# EAGLE design SerLCD_16x2_pb (EAGLE 9.5.2)
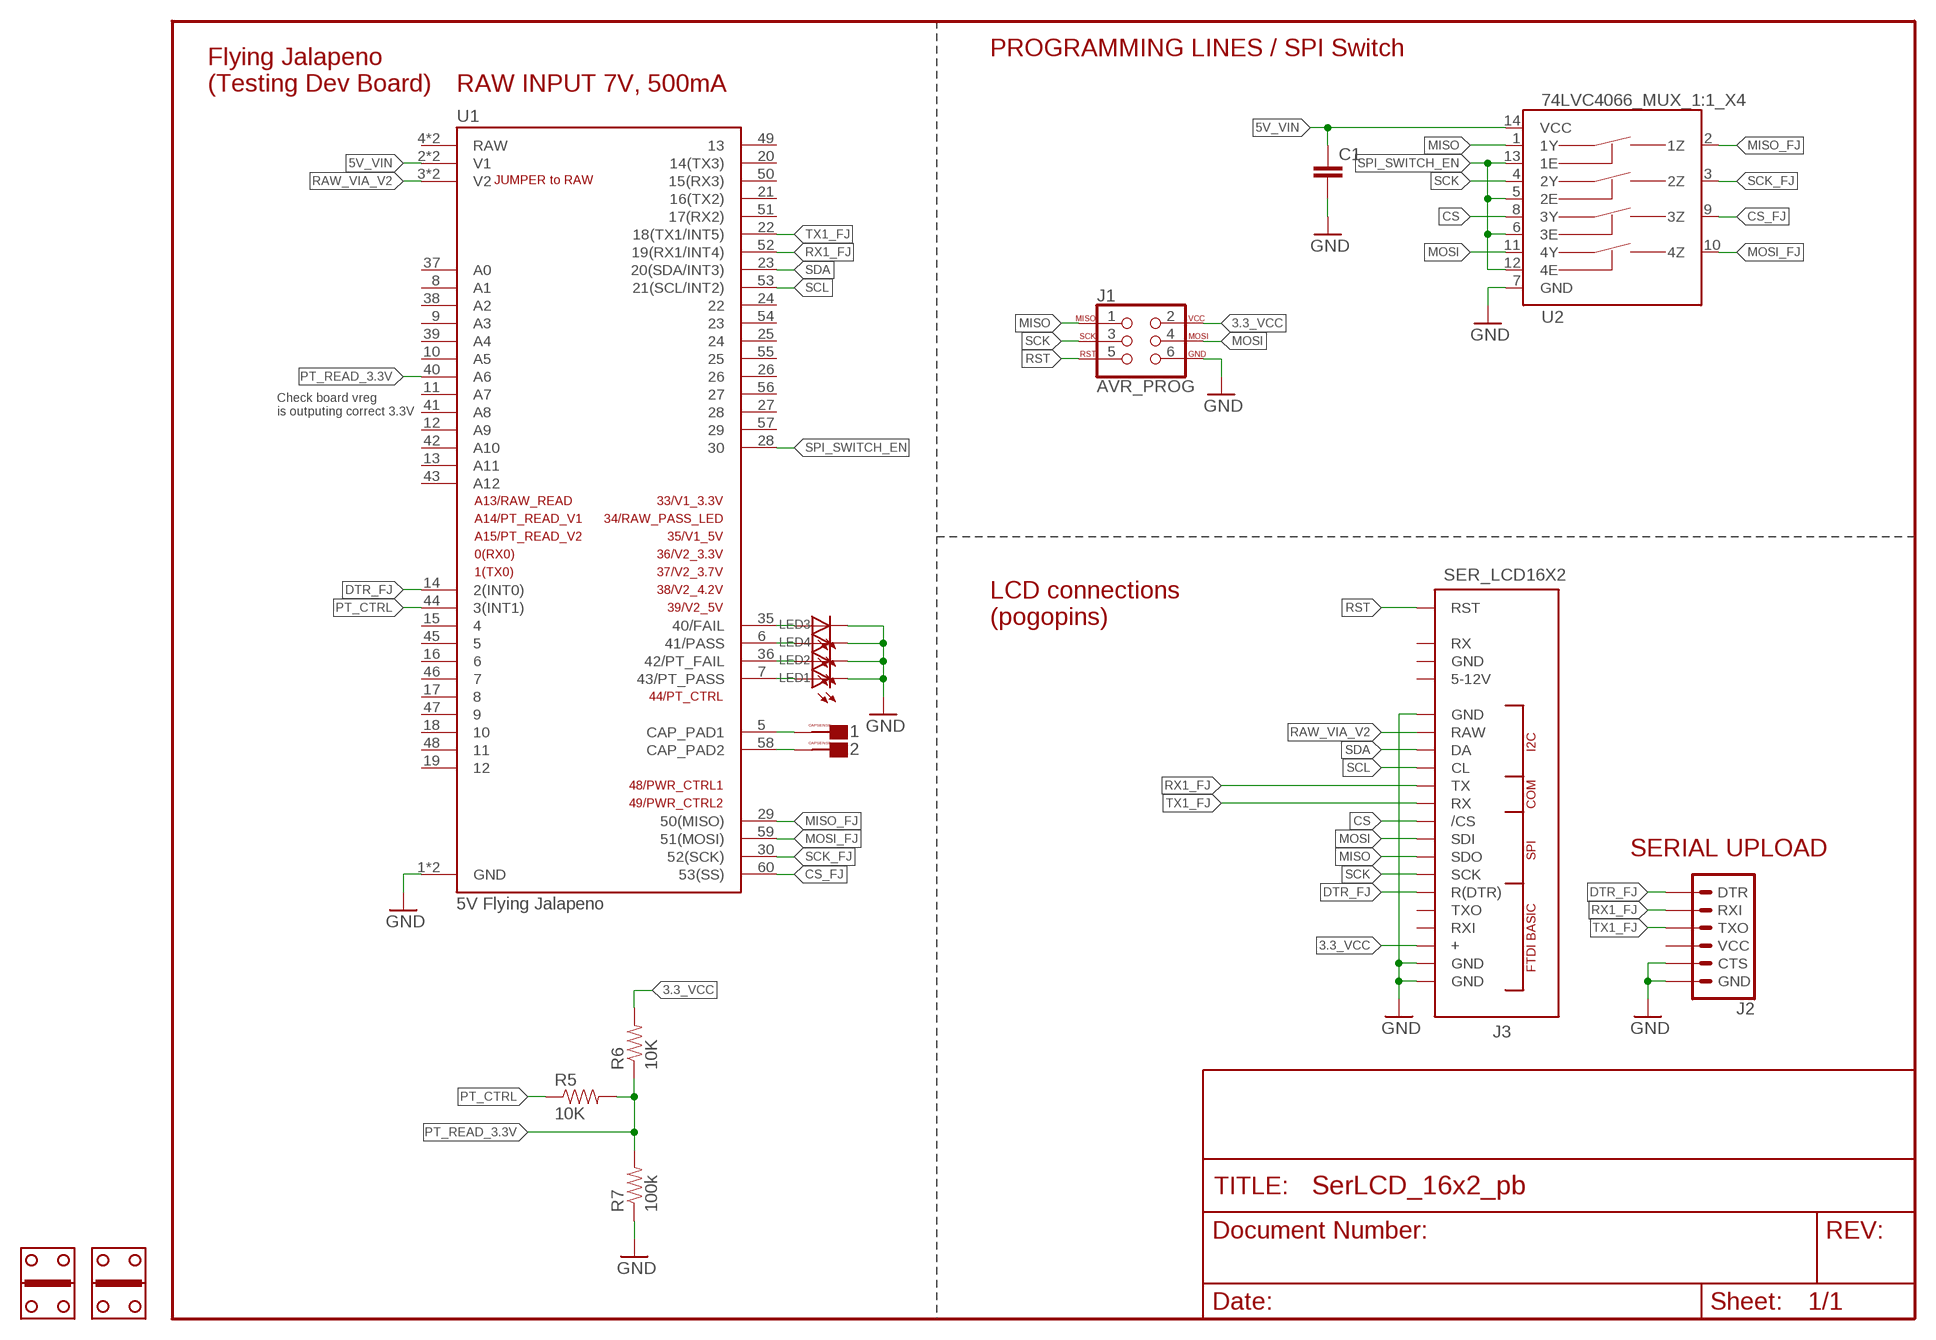
[diagram p0: schematic, sheet 1]

## Parts
1  CAPSENSE_BUTTON_PAD_ONLY  [CAPSENSE_BUTTON_PADS_ONLY]
2  CAPSENSE_BUTTON_PAD_ONLY  [CAPSENSE_BUTTON_PADS_ONLY]
C1  CAP0603-CAP  [0603-CAP]
J1  AVR_PROG  AVR_SPI_PROG_3X22X3_LOCK  [2X3_LOCK]
J2  6_PIN_SERIAL_TARGETLOCK  [1X06_LOCK]
J3  SER_LCD16X2  [SER_LCD_16X2]
LED1  LED1206  [LED-1206]
LED2  LED1206  [LED-1206]
LED3  LED1206  [LED-1206]
LED4  LED1206  [LED-1206]
R5  10K  10KOHM1/10W1%(0603)0603  [0603-RES]
R6  10K  10KOHM1/10W1%(0603)0603  [0603-RES]
R7  100k  100KOHM1/10W1%(0603)  [0603-RES]
U1  5V Flying Jalapeno  FLYING_JALAPENO_V3MALE  [FLYING_JALAPENO_V3_1_M]
U2  74LVC4066_MUX_1:1_X4  [SO14]
U$6  GOLD_HINDGEPB  [GOLD_HINDGE]
U$7  GOLD_HINDGEPB  [GOLD_HINDGE]

## Nets
3.3_VCC: J1.2 J3.P$3(+) R6.2
5V_VIN [twenty_mil]: C1.1 U1.2(V1) U1.32(V1) U2.14(VCC)
CS: J3.P$10(/CS) U2.8(3Y)
CS_FJ: U1.60(53(SS)) U2.9(3Z)
DTR_FJ: J2.1(DTR) J3.P$6(R(DTR)) U1.14(2(INT0))
GND [twelve_mil]: C1.2 J1.6 J2.5(CTS) J2.6(GND) J3.P$1(GND) J3.P$2(GND) J3.P$16(GND) LED1.C LED2.C LED3.C LED4.C R7.1 U1.1(GND) U1.31(GND) U2.7(GND)
MISO: J1.1 J3.P$8(SDO) U2.1(1Y)
MISO_FJ: U1.29(50(MISO)) U2.2(1Z)
MOSI: J1.4 J3.P$9(SDI) U2.11(4Y)
MOSI_FJ: U1.59(51(MOSI)) U2.10(4Z)
N$1 [eight_mil]: 1.CAPSENSE_PAD(CAPSENSE) U1.5(CAP_PAD1)
N$2: 2.CAPSENSE_PAD(CAPSENSE) U1.58(CAP_PAD2)
N$3 [eight_mil]: LED1.A U1.7(43/PT_PASS)
N$4 [eight_mil]: LED2.A U1.36(42/PT_FAIL)
N$5: LED3.A U1.35(40/FAIL)
N$6: LED4.A U1.6(41/PASS)
PT_CTRL: R5.1 U1.44(3(INT1))
PT_READ_3.3V: R5.2 R6.1 R7.2 U1.40(A6)
RAW_VIA_V2: J3.P$15(RAW) U1.3(V2) U1.33(V2)
RST: J1.5 J3.P$20(RST)
RX1_FJ: J2.2(RXI) J3.P$12(TX) U1.52(19(RX1/INT4))
SCK: J1.3 J3.P$7(SCK) U2.4(2Y)
SCK_FJ: U1.30(52(SCK)) U2.3(2Z)
SCL: J3.P$13(CL) U1.53(21(SCL/INT2))
SDA: J3.P$14(DA) U1.23(20(SDA/INT3))
SPI_SWITCH_EN: U1.28 U2.5(2E) U2.6(3E) U2.12(4E) U2.13(1E)
TX1_FJ: J2.3(TXO) J3.P$11(RX) U1.22(18(TX1/INT5))
Unconnected: J2.4(VCC) J3.P$4(RXI) J3.P$5(TXO) J3.P$17(5-12V) J3.P$18(GND) J3.P$19(RX) U1.4(RAW) U1.8(A1) U1.9(A3) U1.10(A5) U1.11(A7) U1.12(A9) U1.13(A11) U1.15 U1.16 U1.17 U1.18 U1.19 U1.20(14(TX3)) U1.21(16(TX2)) U1.24 U1.25 U1.26 U1.27 U1.34(RAW) U1.37(A0) U1.38(A2) U1.39(A4) U1.41(A8) U1.42(A10) U1.43(A12) U1.45 U1.46 U1.47 U1.48 U1.49 U1.50(15(RX3)) U1.51(17(RX2)) U1.54 U1.55 U1.56 U1.57

## Notes on the sheet
- PROGRAMMING LINES / SPI Switch
- Flying Jalapeno
  (Testing Dev Board)
- RAW INPUT 7V, 500mA
- JUMPER to RAW
- Check board vreg 
  is outputing correct 3.3V
- LCD connections
  (pogopins)
- SERIAL UPLOAD

## Library data of the parts
1 2 = Testing:CAPSENSE_BUTTON_PAD_ONLY
C1 = Testing:CAP: Capacitor Standard 0603 ceramic capacitor, and 0.1" leaded capacitor.
J1 = SparkFun-Connectors:AVR_SPI_PROG_3X2: AVR ISP 6 Pin This is the reduced ISP connector for AVR programming. Common on Arduino. This footprint will take up less PCB space and can be used with a 10-pin to 6-pin adapter such as SKU: BOB-08508 **Special note about "TEST_POINT" package. The stop mask is on the top side, so if you want your programming test points to be on the bottom of your board, make sure to place this package on the bottom side of the board. This also ensure that the orientation to program from the bottom side will be correct.
J2 = SparkFun-Connectors:6_PIN_SERIAL_TARGET: 6-pin header connection for use with the "FTDI BASIC" pinout - TARGET SIDE. Also known as "Arduino Serial Program Header". It is used to mate with our FTDI Basic serial programmers using the Arduino IDE. Note, this device has "TARGET" in the name. It is intended to be used on a design that contains a target micro-controller that you wish to program. The "sister" device, named "CABLE" is inteneded to be used on a design that usually lives on the end of your USB cable and prvides the converter chip (FTDI232 or FTDI231x) to commnicate serial RX/TX. You can populate with some of these: Break Away Headers - Straight <https://www.sparkfun.com/products/116> (PRT-00116) For reference (or to suit your programming needs) check out these designs: SparkFun FTDI Basic Breakout - 5V <https://www.sparkfun.com/products/9716> (DEV-09716) SparkFun FTDI Basic Breakout - 3.3V <https://www.sparkfun.com/products/9873> (DEV-09873) SparkFun FTDI SmartBasic <https://www.sparkfun.com/products/12935> (DEV-12935) SparkFun Beefy 3 - FTDI Basic Breakout <https://www.sparkfun.com/products/13746> (DEV-13746)
J3 = SerLCD_dimensions:SER_LCD
LED1-LED4 = Testing:LED: LEDs Standard schematic elements and footprints for 5mm, 3mm, 1206, and 0603 sized LEDs. 5mm - Spark Fun Electronics SKU : COM-00529 (and others)
R5 R6 = SparkFun-Resistors:10KOHM1/10W1%(0603): RES-00824; PROD_ID: RES-00824
R7 = SparkFun-Resistors:100KOHM1/10W1%(0603): RES-07828; PROD_ID: RES-07828
U1 = Testing:FLYING_JALAPENO_V3
U2 = Testing:74LVC4066_MUX_1:1_X4
U$6 U$7 = Testing:GOLD_HINDGE

## Net classes
1 vcc1: width 0.203 mm
3 VCC2: width 0.381 mm, drill 0.508 mm, clearance 0.254 mm to class 0
8 eight_mil: width 0.203 mm, clearance 0.127 mm
9 twelve_mil: width 0.305 mm, clearance 0.127 mm
10 twenty_mil: width 0.508 mm, clearance 0.127 mm
11 thirty_mil: width 0.762 mm, clearance 0.127 mm
13 20_mil: width 0.508 mm, drill 0.508 mm

## Board
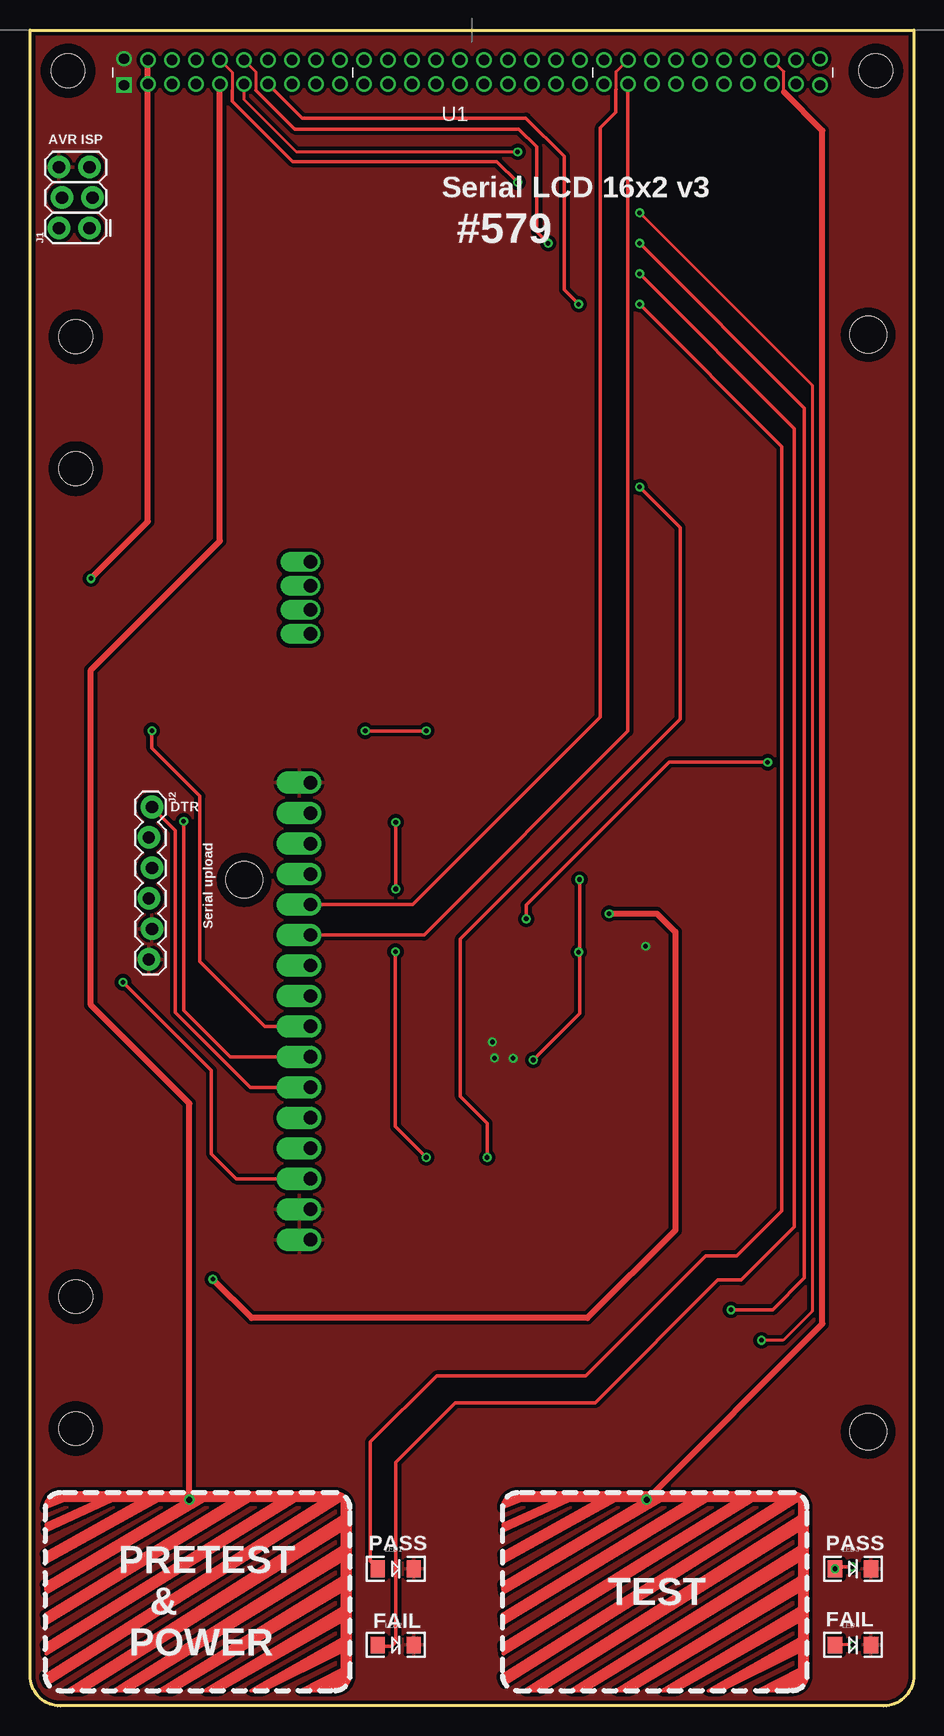
[diagram p1: board, top side]
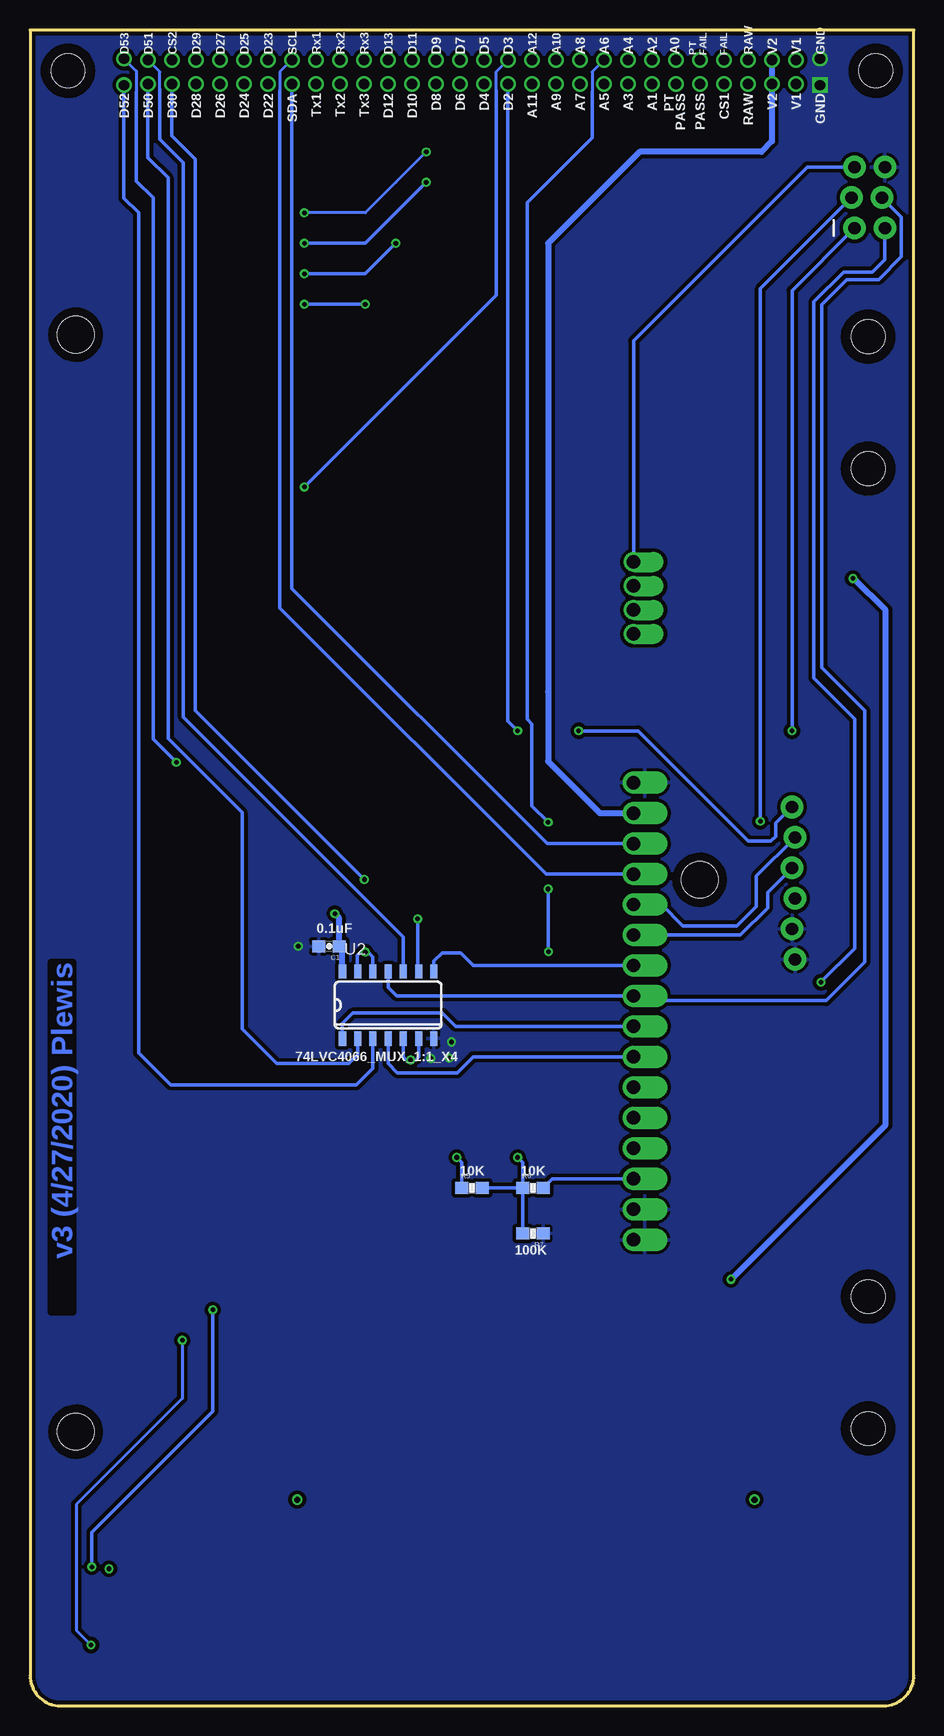
[diagram p2: board, bottom side, seen from below]

Size 73.66 x 139.7 mm. Coordinates in mm from the lower left corner, seen from the top.
Outline: 2.54,0 arc-90 0,2.54 0,139.7 73.66,139.7 73.66,2.54 arc-90 71.12,0 2.54,0
Copper layers (1*16): Top 0.035mm / dielectric 1.5mm / Bottom 0.035mm
Design rules "SparkFun-2-layer-TIGHT *": minimum track width 10mil, minimum drill 15mil, track to track 7mil, track to pad 7mil, pad to pad 7mil, via to via 7mil, smd to smd 7mil, copper to edge 7mil, drill to drill 7mil, minimum pad ring 7mil, minimum via ring 7mil, stop-mask expansion 4mil, vias tented up to drill 25mil, thermal gap 10mil

### Footprints (pad centres in the part's own frame; a part is rotated, then mirrored left to right if it is on the bottom)
CAPSENSE_BUTTON_PADS_ONLY = drill 0.508: CAPSENSE_PAD -0.686,7.036
0603-CAP = smd 1.1 x 1: 1 -0.85,0; 2 0.85,0
2X3_LOCK = drill 1.016 pad 1.88: 1 0,0.127; 2 0,2.667; 3 2.54,-0.127; 4 2.54,2.413; 5 5.08,0.127; 6 5.08,2.667
1X06_LOCK = drill 1.016 pad 1.88: 1 0,0; 2 2.54,-0.254; 3 5.08,0; 4 7.62,-0.254; 5 10.16,0; 6 12.7,-0.254
SER_LCD_16X2 = drill 1.118 pad 1.88 offset: P$1 9.652,33.782; P$2 12.192,33.782; P$3 14.732,33.782; P$4 17.272,33.782; P$5 19.812,33.782; P$6 22.352,33.782; P$7 24.892,33.782; P$8 27.432,33.782; P$9 29.972,33.782; P$10 32.512,33.782; P$11 35.052,33.782; P$12 37.592,33.782; P$13 40.132,33.782; P$14 42.672,33.782; P$15 45.212,33.782; P$16 47.752,33.782 | drill 1.118 pad 1.524 offset: P$17 60.142,33.782; P$18 62.142,33.782; P$19 64.142,33.782; P$20 66.142,33.782
LED-1206 = smd 1.2 x 1.4: A -1.5,0; C 1.5,0
0603-RES = smd 1.1 x 1: 1 -0.85,0; 2 0.85,0
FLYING_JALAPENO_V3_1_M = drill 0.85 square: 1 -29,-4.592 | drill 0.85: 2 -27,-4.492; 3 -25,-4.492; 4 -23,-4.492; 5 -21,-4.492; 6 -19,-4.492; 7 -17,-4.492; 8 -15,-4.492; 9 -13,-4.492; 10 -11,-4.492; 11 -9,-4.492; 12 -7,-4.492; 13 -5,-4.492; 14 -3,-4.492; 15 -1,-4.492; 16 1,-4.492; 17 3,-4.492; 18 5,-4.492; 19 7,-4.492; 20 9,-4.492; 21 11,-4.492; 22 13,-4.492; 23 15,-4.492; 24 17,-4.492; 25 19,-4.492; 26 21,-4.492; 27 23,-4.492; 28 25,-4.492; 29 27,-4.492; 30 29,-4.592; 31 -29,-2.392; 32 -27,-2.492; 33 -25,-2.492; 34 -23,-2.492; 35 -21,-2.492; 36 -19,-2.492; 37 -17,-2.492; 38 -15,-2.492; 39 -13,-2.492; 40 -11,-2.492; 41 -9,-2.492; 42 -7,-2.492; 43 -5,-2.492; 44 -3,-2.492; 45 -1,-2.492; 46 1,-2.492; 47 3,-2.492; 48 5,-2.492; 49 7,-2.492; 50 9,-2.492; 51 11,-2.492; 52 13,-2.492; 53 15,-2.492; 54 17,-2.492; 55 19,-2.492; 56 21,-2.492; 57 23,-2.492; 58 25,-2.492; 59 27,-2.492; 60 29,-2.392 | hole 2.794: 33.655,-3.404; -33.655,-3.404
SO14 = smd 0.6 x 1.2: 1 -3.175,-2.8; 2 -1.905,-2.8; 3 -0.635,-2.8; 4 0.635,-2.8; 5 1.905,-2.8; 6 3.175,-2.8; 7 4.445,-2.8; 8 4.445,2.8; 9 3.175,2.8; 10 1.905,2.8; 11 0.635,2.8; 12 -0.635,2.8; 13 -1.905,2.8; 14 -3.175,2.8
STAND-OFF-TIGHT = hole 3.048: 0,0
GOLD_HINDGE = hole 2.794: 3.81,4.077; 3.81,15.07

### Placement (x,y rotation side)
1  13.97,10.16 0 top
2  52.07,10.16 0 top
C1  48.74,63.32 180 bottom
J1  5.08,123.19 90 top
J2  10.16,74.93 270 top
J3  57.15,29.21 90 top
LED1  30.48,11.43 0 top
LED2  30.48,5.08 0 top
LED3  68.58,11.43 0 top
LED4  68.58,5.08 0 top
R5  36.83,43.18 0 bottom
R6  31.75,43.18 0 bottom
R7  31.75,39.37 180 bottom
U1  36.83,139.7 0 top
U2  44.45,58.42 0 bottom
U$1  [STAND-OFF-TIGHT]  17.85,68.86 0 top
U$3  [STAND-OFF-TIGHT]  69.85,114.3 0 top
U$6  0,99.06 0 top
U$7  0,19.05 0 top
U$8  [STAND-OFF-TIGHT]  69.85,22.86 0 top

### Tracks (layer width: path | path; a pad name or v marks a point on that pad's centre or on a via)
3.3_VCC  (via drill 0.38)
  Top 0.305: v7.75,60.33 15.11,52.96 15.11,46.02 17.2,43.94 J3.P$3
  Bottom 0.305: J1.2 2.41,120.57 3.45,119.53 5.84,119.53 8.33,117.04 8.33,85.67 4.93,82.27 4.93,63.14 v7.75,60.33 | R6.2 30.14,43.94 J3.P$3
5V_VIN  (via drill 0.38)
  Top 0.508: v48.26,66.04 52.25,66.04 53.77,64.52 53.77,39.65 46.46,32.33 18.47,32.33 v15.24,35.56 | v5.08,93.98 9.83,98.73 U1.2 U1.32
  Bottom 0.508: U2.14 47.62,63.05 C1.1 47.89,65.67 v48.26,66.04 | v15.24,35.56 2.36,48.44 2.36,91.34 5,93.98 v5.08,93.98
CS
  Bottom 0.305: J3.P$10 36.73,61.72 37.77,62.76 39.32,62.76 40.01,62.08 U2.8
CS_FJ  (via drill 0.38)
  Top 0.305: v61.47,78.66 53.26,78.66 41.35,66.75 v41.35,65.61
  Bottom 0.254: U1.60 64.8,136.27 64.8,134.49
  Bottom 0.305: 64.8,134.49 64.8,127.1 63.4,125.7 63.4,80.59 v61.47,78.66 | v41.35,65.61 41.35,61.3 U2.9
DTR_FJ  (via drill 0.38)
  Top 0.305: J2.1 12.12,72.97 12.12,57.81 18.36,51.56 J3.P$6 | v33.02,81.28 v27.94,81.28
  Bottom 0.305: U1.14 33.83,82.09 v33.02,81.28 | J2.1 11.51,73.58 11.51,72.49 11.91,72.08 13.79,72.08 22.99,81.28 v27.94,81.28
GND  (via drill 0.38)
  other vias: 38.53,55.35 38.71,54 40.26,53.98 51.31,63.32
  pour Bottom (isolate 0.305): 0,0 0,139.7 73.66,139.7 73.66,0
  pour Top (isolate 0.305): 0,0 0,139.7 73.66,139.7 73.66,0
MISO  (via drill 0.38)
  Top 0.305: J3.P$8 19.56,56.64 14.15,62.05 14.15,75.84 10.16,79.83 v10.16,81.28
  Bottom 0.305: J1.1 10.16,117.98 v10.16,81.28 | J3.P$8 38.18,56.64 39.29,57.76 46.76,57.76 47.62,56.9 U2.1
MISO_FJ
  Bottom 0.305: U2.2 46.35,54.28 47.09,53.54 53.11,53.54 55.98,56.41 55.98,74.47 62.15,80.64 62.15,127.38 63.83,129.06 U1.29
MOSI
  Bottom 0.305: J1.4 1.04,124.1 1.04,120.8 2.95,118.9 5.61,118.9 7.7,116.81 7.7,86.56 4.09,82.96 4.09,62.03 7.32,58.8 22.99,58.8 J3.P$9 43.1,59.18 43.81,59.89 U2.11
MOSI_FJ
  Bottom 0.254: 62.84,134.75 62.84,136.22 U1.59
  Bottom 0.305: U2.10 42.55,64.11 60.88,82.45 60.88,128.65 62.84,130.61 62.84,134.75
N$1
  Top 0.508: 1.CAPSENSE_PAD 13.28,50.22 5.08,58.42 5.08,86.36 15.83,97.11 U1.5
N$2
  Top 0.254: U1.58 62.81,136.22 62.81,134.54
  Top 0.508: 2.CAPSENSE_PAD 66.04,31.85 66.04,131.32 62.81,134.54
N$3  (via drill 0.38)
  Top 0.305: U1.7 22.68,132.36 41.33,132.36 44.53,129.16 44.53,118.03 v45.72,116.84 | v50.8,116.84 62.66,104.98 62.66,41.27 58.9,37.52 56.31,37.52 46.3,27.51 33.88,27.51 28.37,22 28.37,12.04 LED1.A
  Bottom 0.305: v45.72,116.84 v50.8,116.84
N$4  (via drill 0.38)
  Top 0.254: U1.36 18.82,136.22 18.82,134.7
  Top 0.305: 18.82,134.7 22.07,131.44 40.74,131.44 42.22,129.97 42.22,122.89 v43.18,121.92 | v50.8,119.38 63.7,106.48 63.7,39.93 59.28,35.51 57.33,35.51 47.09,25.27 35.43,25.27 30.48,20.32 30.48,5.31 30.15,4.98 29.08,4.98 LED2.A
  Bottom 0.305: v43.18,121.92 45.72,119.38 v50.8,119.38
N$5  (via drill 0.38)
  Top 0.254: U1.35 16.84,136.2 16.84,134.67
  Top 0.305: 16.84,134.67 16.84,133.78 21.89,128.73 38.91,128.73 v40.64,127 | v50.8,121.92 64.54,108.18 64.54,35.66 61.9,33.02 v58.42,33.02 | v68.5,11.58 67.23,11.58 LED3.A
  Bottom 0.305: v50.8,121.92 45.72,121.92 v40.64,127 | v58.42,33.02 58.42,24.56 68.5,14.48 v68.5,11.58
  other vias: 67.08,11.43
N$6  (via drill 0.38)
  Top 0.254: U1.6 17.83,133.91 22.2,129.54 v40.64,129.54 | v50.8,124.46 65.18,110.08 65.18,32.89 62.76,30.48 v60.96,30.48 | v68.58,5.08 LED4.A
  Bottom 0.254: v50.8,124.46 45.72,124.46 43.18,127 v40.64,129.54 | v60.96,30.48 60.96,25.63 69.8,16.79 69.8,6.3 v68.58,5.08
PT_CTRL  (via drill 0.38)
  Top 0.305: v38.1,45.72 38.1,48.56 35.87,50.8 35.87,63.93 54.18,82.25 54.18,98.22 v50.8,101.6
  Bottom 0.254: 34.82,134.7 34.82,136.22 U1.44
  Bottom 0.305: R5.1 37.68,45.3 v38.1,45.72 | v50.8,101.6 34.82,117.58 34.82,134.7
PT_READ_3.3V  (via drill 0.38)
  Top 0.305: v30.48,73.66 v30.48,68.1 | v30.45,62.87 30.45,48.28 v33.02,45.72
  Bottom 0.254: U1.40 26.82,136.22 26.82,134.54
  Bottom 0.305: R7.2 R6.1 | R6.1 R5.2 | 26.82,134.54 26.82,130.73 32.23,125.32 32.23,82.25 31.85,81.86 31.85,75.03 v30.48,73.66 | v30.48,68.1 30.48,62.89 v30.45,62.87 | v33.02,45.72 32.6,45.3 R6.1
RAW_VIA_V2
  Bottom 0.508: J3.P$15 26.16,74.42 30.48,78.74 30.48,84.53 | 30.48,84.53 30.48,121.92 22.86,129.54 12.7,129.54 11.83,130.41 U1.3 U1.33 | 30.45,84.51 30.48,84.53
RST
  Bottom 0.305: J1.5 8.89,128.27 23.37,113.79 J3.P$20
RX1_FJ
  Top 0.254: 48.84,134.77 48.84,136.22 U1.52
  Top 0.305: J3.P$12 31.88,66.8 47.52,82.45 47.52,131.57 48.79,132.84 48.79,134.72 48.84,134.77
  Bottom 0.305: J2.2 13.13,69.16 13.13,66.65 14.76,65.02 19.25,65.02 21.03,66.8 J3.P$12
SCK  (via drill 0.38)
  Top 0.305: J3.P$7 16.69,54.1 12.8,57.99 v12.8,73.74
  Bottom 0.305: J1.3 12.8,118.14 v12.8,73.74 | J3.P$7 36.73,54.1 38.05,52.78 43.05,52.78 43.81,53.54 U2.4
SCK_FJ
  Bottom 0.305: U2.3 45.09,53.14 46.46,51.77 61.95,51.77 64.62,54.43 64.62,124.46 65.83,125.67 U1.30
SCL
  Bottom 0.254: U1.53 52.83,136.21 52.83,134.62
  Bottom 0.305: 52.83,134.62 52.83,91.52 30.66,69.34 J3.P$13
SDA
  Bottom 0.305: U1.23 51.83,93.16 30.56,71.88 J3.P$14
SPI_SWITCH_EN  (via drill 0.38)
  Top 0.305: v45.8,68.89 45.8,62.92 | 45.8,62.92 v45.72,62.84 | v41.94,53.85 45.8,57.71 45.8,62.92
  Bottom 0.305: U2.13 46.38,61.24 46.38,62.53 46.08,62.84 v45.72,62.84 45.49,62.84 45.09,62.43 U2.12 | U1.28 61.83,130.87 59.89,128.93 59.89,82.98 v45.8,68.89 | U2.5 42.55,54.1 42.29,53.85 v41.94,53.85 41.53,53.85 41.27,54.1 U2.6
TX1_FJ
  Top 0.305: U1.22 49.83,81.25 32.84,64.26 J3.P$11
  Bottom 0.305: J3.P$11 14.45,64.26 12.19,66.52 12.19,67.82 J2.3

### Text on the board
Bottom: v3 (4/27/2020) Plewis
tPlace: AVR ISP | Serial LCD 16x2 v3 | #579 | DTR | Serial upload | PASS | PASS | TEST | FAIL | FAIL | PRETEST / & / POWER
bPlace: 0.1uF | 10K | 10K | 100K